# Altium schematic sheet 4_1_frontend.SchDoc: RF FrontEnd module
size A4; OrganizationName: Pluton UPV; Address1: Universitat Politècnica; Address2: de València (UPV); Address3: Camí de Vera, València; Address4: Spain; SheetNumber: 5; SheetTotal: 6
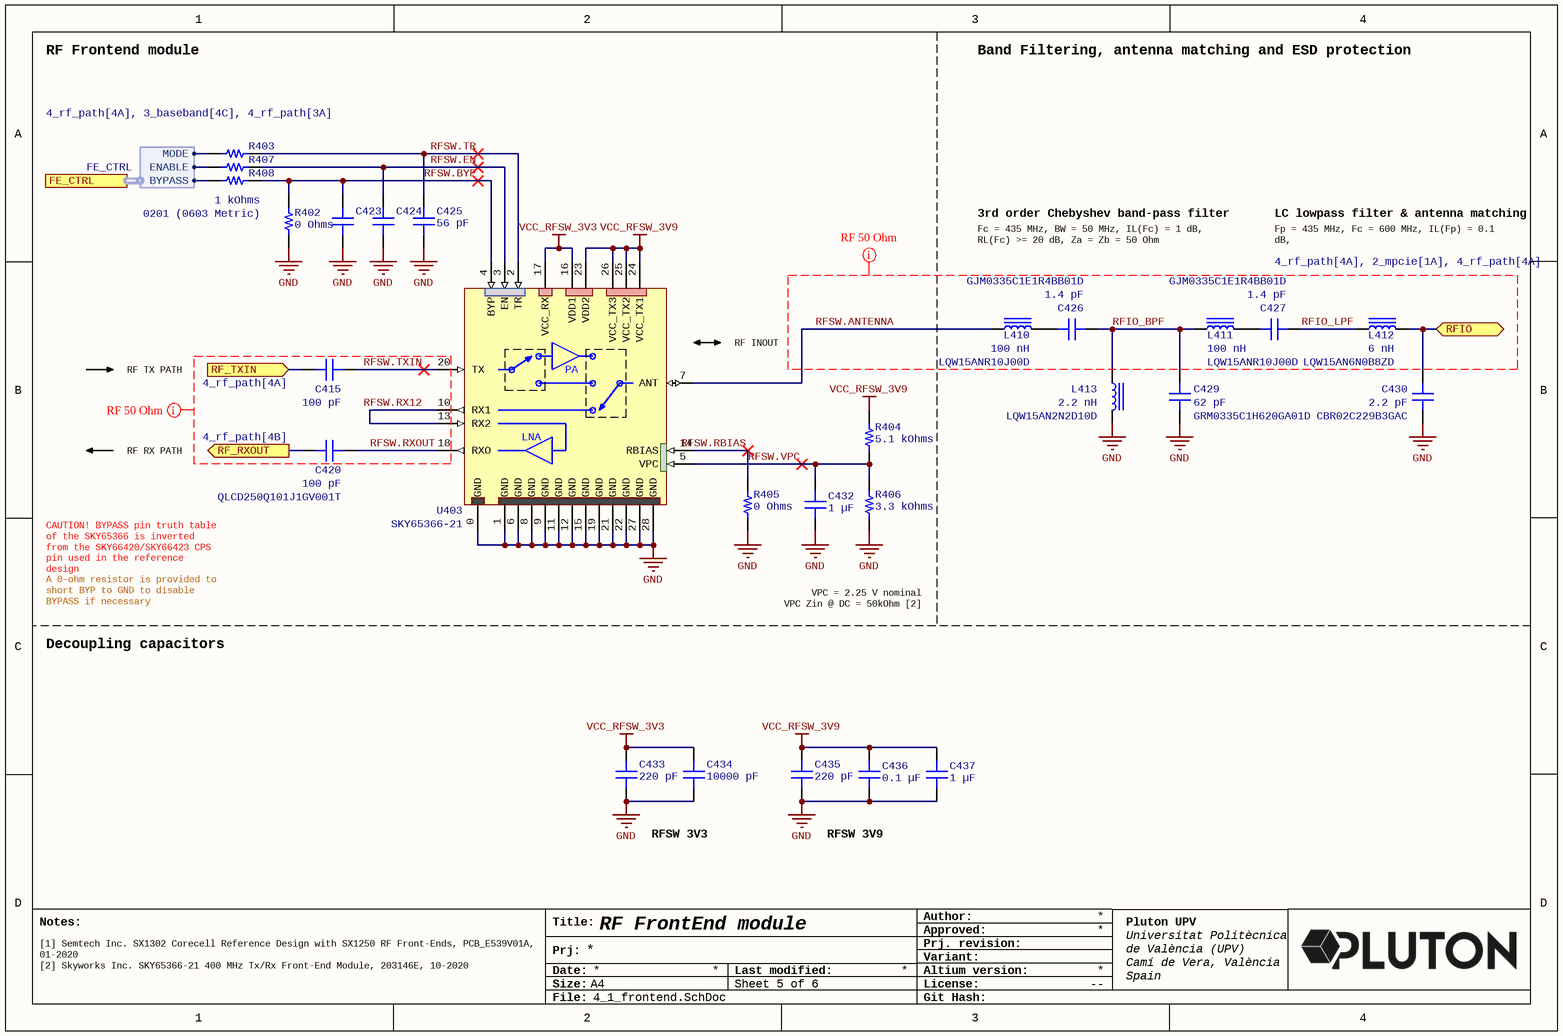
[diagram p0: 4_1_frontend.SchDoc]

## Parts
C415  Part Number: QLCD250Q101J1GV001T  [CAP 0201_0603 RF]  (hidden comment: 100 pF)
C420  100 pF  [CAP 0201_0603 RF]
C423  56 pF  [CAP 0201_0603]  (value not drawn)
C424  56 pF  [CAP 0201_0603]  (value not drawn)
C425  56 pF  [CAP 0201_0603]
C426  Part Number: GJM0335C1E1R4BB01D  [CAP 0201_0603 RF]  (hidden comment: 1.4 pF)
C427  Part Number: GJM0335C1E1R4BB01D  [CAP 0201_0603 RF]  (hidden comment: 1.4 pF)
C429  Part Number: GRM0335C1H620GA01D  [CAP 0201_0603]  (hidden comment: 62 pF)
C430  Part Number: CBR02C229B3GAC  [CAP 0201_0603 RF]  (hidden comment: 2.2 pF)
C432  1 µF  [CAP 0402_1005]
C433  220 pF  [CAP 0201_0603]
C434  10000 pF  [CAP 0402_1005]
C435  220 pF  [CAP 0201_0603]
C436  0.1 µF  [CAP 0402_1005]
C437  1 µF  [CAP 0402_1005]
L410  Part Number: LQW15ANR10J00D  [IND 0402_1005 RF WW]  (hidden comment: 100 nH)
L411  Part Number: LQW15ANR10J00D  [IND 0402_1005 RF WW]  (hidden comment: 100 nH)
L412  Part Number: LQW15AN6N0B8ZD  [IND 0402_1005 RF WW]  (hidden comment: 6 nH)
L413  Part Number: LQW15AN2N2D10D  [IND 0402_1005 RF WW]  (hidden comment: 2.2 nH)
R402  0 Ohms  [RES 0201_0603]
R403  Device Package: 0201 (0603 Metric)  [RES 0201_0603]  (hidden comment: 1 kOhms)
R404  5.1 kOhms  [RES 0201_0603]
R405  0 Ohms  [RES 0201_0603]
R406  3.3 kOhms  [RES 0201_0603]
R407  1 kOhms  [RES 0201_0603]  (value not drawn)
R408  1 kOhms  [RES 0201_0603]  (value not drawn)
U403  SKY65366-21  [MCM-28-SKY65366-21]

## Ports
FE_CTRL (harness FE_CTRL, see 4_rf_path[4A], 3_baseband[4C], 4_rf_path[3A]), RF_RXOUT (out, see 4_rf_path[4B]), RF_TXIN (in, see 4_rf_path[4A]), RFIO (bidir, see 4_rf_path[4A], 2_mpcie[1A], 4_rf_path[4A])

## Harnesses
FE_CTRL: MODE, ENABLE, BYPASS

## Nets
GND: C423.1 C424.1 C425.1 C429.1 C430.1 C432.1 C433.1 C434.1 C435.1 C436.1 C437.1 L413.2 R402.1 R405.1 R406.1 U403.0(GND) U403.1(GND) U403.6(GND) U403.8(GND) U403.9(GND) U403.11(GND) U403.12(GND) U403.15(GND) U403.19(GND) U403.21(GND) U403.22(GND) U403.27(GND) U403.28(GND)
VCC_RFSW_3V3: C433.2 C434.2 U403.16(VDD1) U403.17(VCC_RX)
VCC_RFSW_3V9: C435.2 C436.2 C437.2 R404.2 U403.23(VDD2) U403.24(VCC_TX1) U403.25(VCC_TX2) U403.26(VCC_TX3)
RF_RXOUT: C420.1 ; port RF_RXOUT
RF_TXIN: C415.1 ; port RF_TXIN
RFIO: C430.2 L412.2 ; port RFIO
RFIO_BPF: C426.2 C429.2 L411.1 L413.1
RFIO_LPF: C427.2 L412.1
RFSW.ANTENNA: L410.1 U403.7(ANT)
RFSW.BYP: C423.2 R402.2 R408.2 U403.4(BYP)
RFSW.EN: C424.2 R407.2 U403.3(EN)
RFSW.RBIAS: R405.2 U403.14(RBIAS)
RFSW.RX12: U403.10(RX1) U403.13(RX2)
RFSW.RXOUT: C420.2 U403.18(RXO)
RFSW.TR: C425.2 R403.2 U403.2(TR)
RFSW.TXIN: C415.2 U403.20(TX)
RFSW.VPC: C432.2 R404.1 R406.2 U403.5(VPC)
NetC426_1: C426.1 L410.2
NetC427_1: C427.1 L411.2
NetR403_1: R403.1 ; port FE_CTRL.MODE
NetR407_1: R407.1 ; port FE_CTRL.ENABLE
NetR408_1: R408.1 ; port FE_CTRL.BYPASS

## Layout directives
net class RF50; rule Width Constraint [Pref Impedance = 50.00ohms    Min Impedance = 50.00ohms    Max Impedance = 50.00ohms]; rule Clearance Constraint [Clearance = 0.2mm]: RFIO_BPF, RFIO_LPF, RFSW.ANTENNA, RFSW.RX12, RFSW.RXOUT, RFSW.TXIN

## Notes on the sheet
- RF Frontend module
- Band Filtering, antenna matching and ESD protection
- 3rd order Chebyshev band-pass filter
- Fc = 435 MHz, BW = 50 MHz, IL(Fc) = 1 dB, RL(Fc) >= 20 dB, Za = Zb = 50 Ohm
- LC lowpass filter & antenna matching
- Fp = 435 MHz, Fc = 600 MHz, IL(Fp) = 0.1 dB,
  RL(Fp) >= 50 dB, Zin = 50 Ohm, Zant = 55 Ohm
- RF TX PATH
- RF INOUT
- RF RX PATH
- CAUTION! BYPASS pin truth table of the SKY65366 is inverted from the SKY66420/SKY66423 CPS pin used in the reference design
- A 0-ohm resistor is provided to short BYP to GND to disable BYPASS if necessary
- Decoupling capacitors
- VPC = 2.25 V nominal
  VPC Zin @ DC = 50kOhm [2]
- RFSW 3V3
- RFSW 3V9
- [1] Semtech Inc. SX1302 Corecell Reference Design with SX1250 RF Front-Ends, PCB_E539V01A, 01-2020
  [2] Skyworks Inc. SKY65366-21 400 MHz Tx/Rx Front-End Module, 203146E, 10-2020
- Notes:
- Title:
- Author:
- Approved:
- Date:
- Prj:
- Size:
- A4
- Last modified:
- Altium version:
- Variant:
- Prj. revision:
- License:
- --
- File:
- Git Hash:
- (in symbol SKY65366-21) PA; LNA

## Library data of the parts
C415 C420 = QLCD250Q101J1GV001T: CAP CER 100PF 25V C0G/NP0 0201; manufacturer: Johanson Technology Inc.; Temperature Coefficient: C0G, NP0; Tolerance: ±5%; Applications: RF, Microwave, High Frequency; Capacitance: 100 pF; componentlink1description: Datasheet; componentlink1url: https://www.johansontechnology.com/downloads/catalog/johanson-technology-multi-layer-high-q-capacitors.pdf; componentlink2description: DigiKey Link; componentlink2url: https://www.digikey.com/en/products/detail/johanson-technology-inc/QLCD250Q101J1GV001T/1561511; Device Package: 0201 (0603 Metric); Features: High Q, Low Loss; lastupdated: 03/06/2024 19:34:07; Lifecycle Status: Active; Minimum Order: 1; Mounting Type: Surface Mount, MLCC; Operating Temperature: -55°C ~ 125°C; Package / Case: 0201 (0603 Metric); packaging: TapeAndReel; partid: 3724; Part Status: Active; price: 0.02; series: L; Size / Dimension: 0.024" L x 0.012" W (0.60mm x 0.30mm); Supplier 1: DigiKey; Supplier Part Number 1: 712-QLCD250Q101J1GV001TCT-ND; Thickness (Max): 0.013" (0.33mm); value: 100 pF; Voltage - Rated: 25V
  C420: Part Number: QLCD250Q101J1GV001T
C423-C425 = GRM0335C1H560GA01D: CAP CER 56PF 50V C0G/NP0 0201; manufacturer: Murata Electronics; Temperature Coefficient: C0G, NP0; Tolerance: ±2%; Part Number: GRM0335C1H560GA01D; Value: 56 pF; Applications: General Purpose; Capacitance: 56 pF; componentlink1description: Datasheet; componentlink1url: https://search.murata.co.jp/Ceramy/image/img/A01X/G101/ENG/GRM0335C1H560GA01-01.pdf; componentlink2description: DigiKey Link; componentlink2url: https://www.digikey.com/en/products/detail/murata-electronics/GRM0335C1H560GA01D/4358755; Device Package: 0201 (0603 Metric); lastupdated: 04/06/2024 19:01:09; Lifecycle Status: Active; Minimum Order: 1; Mounting Type: Surface Mount; Operating Temperature: -55°C ~ 125°C; Package / Case: 0201 (0603 Metric); packaging: CutTape; partid: 528; Part Status: Active; price: 0.01; series: GRM; Size / Dimension: 0.024" L x 0.012" W (0.60mm x 0.30mm); Supplier 1: DigiKey; Supplier Part Number 1: 490-13329-1-ND; Thickness (Max): 0.013" (0.33mm); Voltage - Rated: 50V
C426 C427 = GJM0335C1E1R4BB01D: CAP CER 1.4PF 25V C0G/NP0 0201; manufacturer: Murata Electronics; Temperature Coefficient: C0G, NP0; Tolerance: ±0.1pF; Applications: RF, Microwave, High Frequency; Capacitance: 1.4 pF; componentlink1description: Datasheet; componentlink1url: https://search.murata.co.jp/Ceramy/image/img/A01X/G101/ENG/GJM0335C1E1R4BB01-01.pdf; componentlink2description: DigiKey Link; componentlink2url: https://www.digikey.com/en/products/detail/murata-electronics/GJM0335C1E1R4BB01D/2592522; Device Package: 0201 (0603 Metric); Features: High Q, Low Loss; lastupdated: 03/06/2024 19:34:09; Lifecycle Status: Active; Minimum Order: 1; Mounting Type: Surface Mount; Operating Temperature: -55°C ~ 125°C; Package / Case: 0201 (0603 Metric); packaging: TapeAndReel; partid: 255; Part Status: Active; price: 0.01; series: GJM; Size / Dimension: 0.024" L x 0.012" W (0.60mm x 0.30mm); Supplier 1: DigiKey; Supplier Part Number 1: 490-11174-1-ND; Thickness (Max): 0.013" (0.33mm); value: 1.4 pF; Voltage - Rated: 25V
C429 = GRM0335C1H620GA01D: CAP CER 62PF 50V C0G/NP0 0201; manufacturer: Murata Electronics; Temperature Coefficient: C0G, NP0; Tolerance: ±2%; Value: 62 pF; Applications: General Purpose; Capacitance: 62 pF; componentlink1description: Datasheet; componentlink1url: https://www.murata.com/~/media/webrenewal/support/library/catalog/products/capacitor/mlcc/c02e.ashx?la=en-us; componentlink2description: DigiKey Link; componentlink2url: https://www.digikey.com/en/products/detail/murata-electronics/GRM0335C1H620GA01D/4358769; Device Package: 0201 (0603 Metric); lastupdated: 04/06/2024 19:01:09; Lifecycle Status: Active; Minimum Order: 1; Mounting Type: Surface Mount; Operating Temperature: -55°C ~ 125°C; Package / Case: 0201 (0603 Metric); packaging: CutTape; partid: 542; Part Status: Active; price: 0.01; series: GRM; Size / Dimension: 0.024" L x 0.012" W (0.60mm x 0.30mm); Supplier 1: DigiKey; Supplier Part Number 1: 490-11337-1-ND; Thickness (Max): 0.013" (0.33mm); Voltage - Rated: 50V
C430 = CBR02C229B3GAC: CAP CER 2.2PF 25V C0G/NP0 0201; manufacturer: KEMET; Temperature Coefficient: C0G, NP0; Tolerance: ±0.1pF; Applications: RF, Microwave, High Frequency; Capacitance: 2.2 pF; componentlink1description: Datasheet; componentlink1url: https://api.kemet.com/component-edge/download/datasheet/CBR02C229B3GAC.pdf; componentlink2description: DigiKey Link; componentlink2url: https://www.digikey.com/en/products/detail/kemet/CBR02C229B3GAC/3479233; Device Package: 0201 (0603 Metric); Features: High Q, Low Loss, Ultra Low ESR; lastupdated: 03/06/2024 19:34:10; Lifecycle Status: Active; Minimum Order: 1; Mounting Type: Surface Mount, MLCC; Operating Temperature: -55°C ~ 125°C; Package / Case: 0201 (0603 Metric); packaging: TapeAndReel; partid: 161; Part Status: Active; price: 0.02; series: CBR-SMD RF C0G; Size / Dimension: 0.024" L x 0.012" W (0.60mm x 0.30mm); Supplier 1: DigiKey; Supplier Part Number 1: 399-8607-1-ND; Thickness (Max): 0.013" (0.33mm); value: 2.2 pF; Voltage - Rated: 25V
C432 = CL05A105KO5NNNC: CAP CER 1UF 16V X5R 0402; manufacturer: Samsung Electro-Mechanics; Tolerance: ±10%; Part Number: CL05A105KO5NNNC; Value: 1 µF; Applications: General Purpose; Capacitance: 1 µF; componentlink1description: Datasheet; componentlink1url: http://www.samsungsem.com/kr/support/product-search/mlcc/CL05A105KO5NNNC.jsp; componentlink2description: DigiKey Link; componentlink2url: https://www.digikey.com/en/products/detail/samsung-electro-mechanics/CL05A105KO5NNNC/3886725; Device Package: 0402 (1005 Metric); lastupdated: 09/02/2024 20:04:35; Lifecycle Status: Active; Minimum Order: 1; Mounting Type: Surface Mount, MLCC; Operating Temperature: -55°C ~ 85°C; Package / Case: 0402 (1005 Metric); packaging: TapeAndReel; partid: 3120; Part Status: Active; price: 0.01; series: CL; Size / Dimension: 0.039" L x 0.020" W (1.00mm x 0.50mm); Supplier 1: DigiKey; Supplier Part Number 1: 1276-1067-1-ND; Temperature Coefficient: X5R; Thickness (Max): 0.022" (0.55mm); Voltage - Rated: 16V
C433 C435 = GRM0335C1H221JA01D: CAP CER 220PF 50V C0G/NP0 0201; manufacturer: Murata Electronics; Temperature Coefficient: C0G, NP0; Tolerance: ±5%; Part Number: GRM0335C1H221JA01D; Value: 220 pF; Applications: General Purpose; Capacitance: 220 pF; componentlink1description: Datasheet; componentlink1url: https://search.murata.co.jp/Ceramy/image/img/A01X/G101/ENG/GRM0335C1H221JA01-01.pdf; componentlink2description: DigiKey Link; componentlink2url: https://www.digikey.com/en/products/detail/murata-electronics/GRM0335C1H221JA01D/4904370; Device Package: 0201 (0603 Metric); lastupdated: 04/06/2024 19:01:09; Lifecycle Status: Active; Minimum Order: 1; Mounting Type: Surface Mount; Operating Temperature: -55°C ~ 125°C; Package / Case: 0201 (0603 Metric); packaging: CutTape; partid: 574; Part Status: Active; price: 0.01; series: GRM; Size / Dimension: 0.024" L x 0.012" W (0.60mm x 0.30mm); Supplier 1: DigiKey; Supplier Part Number 1: 490-11316-1-ND; Thickness (Max): 0.013" (0.33mm); Voltage - Rated: 50V
C434 = GRM1555C1E103JE01J: CAP CER 10000PF 25V C0G/NP0 0402; manufacturer: Murata Electronics; Temperature Coefficient: C0G, NP0; Tolerance: ±5%; Part Number: GRM1555C1E103JE01J; Value: 10000 pF; Applications: General Purpose; Capacitance: 10000 pF; componentlink1description: Datasheet; componentlink1url: https://search.murata.co.jp/Ceramy/image/img/A01X/G101/ENG/GRM1555C1E103JE01-01A.pdf; componentlink2description: DigiKey Link; componentlink2url: https://www.digikey.com/en/products/detail/murata-electronics/GRM1555C1E103JE01J/16033801; Device Package: 0402 (1005 Metric); lastupdated: 09/02/2024 20:04:09; Lifecycle Status: Active; Minimum Order: 1; Mounting Type: Surface Mount, MLCC; Operating Temperature: -55°C ~ 125°C; Package / Case: 0402 (1005 Metric); packaging: TapeAndReel; partid: 41084; Part Status: Active; price: 0.02; series: GRM; Size / Dimension: 0.039" L x 0.020" W (1.00mm x 0.50mm); Supplier 1: DigiKey; Supplier Part Number 1: 490-GRM1555C1E103JE01JCT-ND; Thickness (Max): 0.026" (0.65mm); Voltage - Rated: 25V
C436 = C0402C104K4RECAUTO: CAP CER 0402 0.1UF 16V X7R 10%; manufacturer: KEMET; Part Number: C0402C104K4RECAUTO; Value: 0.1 µF; Applications: Automotive, ESD Protection; Capacitance: 0.1 µF; componentlink1description: Datasheet; componentlink1url: https://api.kemet.com/component-edge/download/datasheet/C0402C104K4RECAUTO.pdf; componentlink2description: DigiKey Link; componentlink2url: https://www.digikey.com/en/products/detail/kemet/C0402C104K4RECAUTO/8563695; Device Package: 0402 (1005 Metric); lastupdated: 09/02/2024 20:04:38; Lifecycle Status: Active; Minimum Order: 1; Mounting Type: Surface Mount, MLCC; Operating Temperature: -55°C ~ 125°C; Package / Case: 0402 (1005 Metric); packaging: TapeAndReel; partid: 1731; Part Status: Active; price: 0.01; Ratings: AEC-Q200; series: ESD SMD Auto X7R; Size / Dimension: 0.039" L x 0.020" W (1.00mm x 0.50mm); Supplier 1: DigiKey; Supplier Part Number 1: 399-17167-1-ND; Temperature Coefficient: X7R; Thickness (Max): 0.022" (0.55mm); Tolerance: ±10%; Voltage - Rated: 16V
C437 = GRT155C71A105KE13D: CAP CER 1UF 10V X7S 0402; manufacturer: Murata Electronics; Tolerance: ±10%; Part Number: GRT155C71A105KE13D; Value: 1 µF; Applications: Automotive; Capacitance: 1 µF; componentlink1description: Datasheet; componentlink1url: https://search.murata.co.jp/Ceramy/image/img/A01X/G101/ENG/GRT155C71A105KE13-01.pdf; componentlink2description: DigiKey Link; componentlink2url: https://www.digikey.com/en/products/detail/murata-electronics/GRT155C71A105KE13D/10695747; Device Package: 0402 (1005 Metric); lastupdated: 09/02/2024 20:04:05; Lifecycle Status: Active; Minimum Order: 1; Mounting Type: Surface Mount, MLCC; Operating Temperature: -55°C ~ 125°C; Package / Case: 0402 (1005 Metric); packaging: TapeAndReel; partid: 47127; Part Status: Active; price: 0.04; Ratings: AEC-Q200; series: GRT; Size / Dimension: 0.039" L x 0.020" W (1.00mm x 0.50mm); Supplier 1: DigiKey; Supplier Part Number 1: 490-GRT155C71A105KE13DCT-ND; Temperature Coefficient: X7S; Thickness (Max): 0.024" (0.60mm); Voltage - Rated: 10V
L410 L411 = LQW15ANR10J00D: FIXED IND 100NH 120MA 2.52OHM SM; Manufacturer: Murata Electronics; DC Resistance (DCR): 2.52Ohm Max; Frequency - Self Resonant: 1.5GHz; Inductance Frequency - Test: 100 MHz; Material - Core: Non-Magnetic; Q @ Freq: 20 @ 150MHz; Shielding: Unshielded; Tolerance: ±5%; Type: Drum Core, Wirewound; ComponentLink1Description: Datasheet; ComponentLink1URL: https://search.murata.co.jp/Ceramy/image/img/P02/JELF243A-0050.pdf; ComponentLink2Description: DigiKey Link; ComponentLink2URL: https://www.digikey.com/en/products/detail/murata-electronics/LQW15ANR10J00D/1016249; Current Rating (Amps): 120 mA; Device Package: 0402 (1005 Metric); Height - Seated (Max): 0.024" (0.60mm); Inductance: 100 nH; LastUpdated: 03/06/2024 20:03:22; Lifecycle Status: Active; Minimum Order: 1; Mounting Type: Surface Mount; Operating Temperature: -55°C ~ 125°C; Package / Case: 0402 (1005 Metric); Packaging: TapeAndReel; PartId: 282; Part Status: Active; Price: 0.04; Series: LQW15; Size / Dimension: 0.039" L x 0.020" W (1.00mm x 0.50mm); Supplier 1: DigiKey; Supplier Part Number 1: 490-4090-1-ND; Value: 100 nH
L412 = LQW15AN6N0B8ZD: FIXED IND 6NH 1.6A 0.056OHM SMD; Manufacturer: Murata Electronics; DC Resistance (DCR): 56mOhm Max; Frequency - Self Resonant: 8GHz; Inductance Frequency - Test: 100 MHz; Material - Core: Non-Magnetic; Q @ Freq: 32 @ 250MHz; Shielding: Unshielded; Tolerance: ±0.1nH; Type: Drum Core, Wirewound; ComponentLink1Description: Datasheet; ComponentLink1URL: https://search.murata.co.jp/Ceramy/image/img/P02/JELF243A-9138.pdf; ComponentLink2Description: DigiKey Link; ComponentLink2URL: https://www.digikey.com/en/products/detail/murata-electronics/LQW15AN6N0B8ZD/6798964; Current Rating (Amps): 1.6 A; Device Package: 0402 (1005 Metric); Height - Seated (Max): 0.024" (0.60mm); Inductance: 6 nH; LastUpdated: 03/06/2024 20:03:25; Lifecycle Status: Active; Minimum Order: 1; Mounting Type: Surface Mount; Operating Temperature: -55°C ~ 125°C; Package / Case: 0402 (1005 Metric); Packaging: TapeAndReel; PartId: 40; Part Status: Active; Price: 0.07; Ratings: AEC-Q200; Series: LQW15; Size / Dimension: 0.039" L x 0.024" W (1.00mm x 0.60mm); Supplier 1: DigiKey; Supplier Part Number 1: 490-15539-1-ND; Value: 6 nH
L413 = LQW15AN2N2D10D: FIXED IND 2.2NH 1A 0.027OHM SMD; Manufacturer: Murata Electronics; DC Resistance (DCR): 27mOhm Max; Frequency - Self Resonant: 14GHz; Inductance Frequency - Test: 100 MHz; Material - Core: Non-Magnetic; Q @ Freq: 25 @ 250MHz; Shielding: Unshielded; Tolerance: ±0.5nH; Type: Drum Core, Wirewound; ComponentLink1Description: Datasheet; ComponentLink1URL: https://search.murata.co.jp/Ceramy/image/img/P02/JELF243A-0051.pdf; ComponentLink2Description: DigiKey Link; ComponentLink2URL: https://www.digikey.com/en/products/detail/murata-electronics/LQW15AN2N2D10D/2594881; Current Rating (Amps): 1 A; Device Package: 0402 (1005 Metric); Height - Seated (Max): 0.024" (0.60mm); Inductance: 2.2 nH; LastUpdated: 03/06/2024 20:03:23; Lifecycle Status: Active; Minimum Order: 1; Mounting Type: Surface Mount; Operating Temperature: -55°C ~ 125°C; Package / Case: 0402 (1005 Metric); Packaging: TapeAndReel; PartId: 170; Part Status: Active; Price: 0.05; Series: LQW15; Size / Dimension: 0.039" L x 0.024" W (1.00mm x 0.60mm); Supplier 1: DigiKey; Supplier Part Number 1: 490-6795-1-ND; Value: 2.2 nH
R402 R405 = AC0201JR-070RL: RES SMD 0 OHM JUMPER 1/20W 0201; Manufacturer: Yageo; Power (Watts): 0.05W, 1/20W; Part Number: AC0201JR-070RL; Value: 0 Ohms; ComponentLink1Description: Datasheet; ComponentLink1URL: https://www.yageo.com/upload/media/product/productsearch/datasheet/rchip/PYu-AC_51_RoHS_L_7.pdf; ComponentLink2Description: DigiKey Link; ComponentLink2URL: https://www.digikey.com/en/products/detail/yageo/AC0201JR-070RL/5894880; Composition: Thick Film; Device Package: 0201 (0603 Metric); Features: Automotive AEC-Q200, Moisture Resistant; Height - Seated (Max): 0.010" (0.26mm); LastUpdated: 04/06/2024 19:12:00; Lifecycle Status: Active; Minimum Order: 1; Number of Terminations: 2; Operating Temperature: -55°C ~ 155°C; Package / Case: 0201 (0603 Metric); Packaging: CutTape; PartId: 818; Part Status: Active; Price: 0.01; Ratings: AEC-Q200; Resistance: 0 Ohms; Series: AC; Size / Dimension: 0.024" L x 0.012" W (0.60mm x 0.30mm); Supplier 1: DigiKey; Supplier Part Number 1: YAG3427CT-ND; Supplier Device Package: 0201; Tolerance: Jumper
R403 R407 R408 = RC0201FR-071KL: RES 1K OHM 1% 1/20W 0201; Manufacturer: Yageo; Power (Watts): 0.05W, 1/20W; Temperature Coefficient: ±200ppm/°C; Part Number: RC0201FR-071KL; Value: 1 kOhms; ComponentLink1Description: Datasheet; ComponentLink1URL: https://www.yageo.com/upload/media/product/productsearch/datasheet/rchip/PYu-RC_Group_51_RoHS_L_10.pdf; ComponentLink2Description: DigiKey Link; ComponentLink2URL: https://www.digikey.com/en/products/detail/yageo/RC0201FR-071KL/3202389; Composition: Thick Film; Features: Moisture Resistant; Height - Seated (Max): 0.010" (0.26mm); LastUpdated: 04/06/2024 19:11:56; Lifecycle Status: Active; Minimum Order: 1; Number of Terminations: 2; Operating Temperature: -55°C ~ 125°C; Package / Case: 0201 (0603 Metric); Packaging: TapeAndReel; PartId: 2286; Part Status: Active; Price: 0.01; Resistance: 1 kOhms; Series: RC_L; Size / Dimension: 0.024" L x 0.012" W (0.60mm x 0.30mm); Supplier 1: DigiKey; Supplier Part Number 1: 311-1KMCT-ND; Supplier Device Package: 0201; Tolerance: ±1%
  R407 R408: Device Package: 0201 (0603 Metric)
R404 = ERJ-1GNF5101C: RES SMD 5.1K OHM 1% 1/20W 0201; Manufacturer: Panasonic Electronic Components; Power (Watts): 0.05W, 1/20W; Temperature Coefficient: ±200ppm/°C; Part Number: ERJ-1GNF5101C; Value: 5.1 kOhms; ComponentLink1Description: Datasheet; ComponentLink1URL: https://industrial.panasonic.com/cdbs/www-data/pdf/RDA0000/AOA0000C304.pdf; ComponentLink2Description: DigiKey Link; ComponentLink2URL: https://www.digikey.com/en/products/detail/panasonic-electronic-components/ERJ-1GNF5101C/2036192; Composition: Thick Film; Device Package: 0201 (0603 Metric); Features: Automotive AEC-Q200; Height - Seated (Max): 0.010" (0.26mm); LastUpdated: 04/06/2024 19:11:52; Lifecycle Status: Active; Minimum Order: 1; Number of Terminations: 2; Operating Temperature: -55°C ~ 125°C; Package / Case: 0201 (0603 Metric); Packaging: TapeAndReel; PartId: 4177; Part Status: Active; Price: 0.01; Ratings: AEC-Q200; Resistance: 5.1 kOhms; Series: ERJ-1GN; Size / Dimension: 0.024" L x 0.012" W (0.60mm x 0.30mm); Supplier 1: DigiKey; Supplier Part Number 1: P123051CT-ND; Supplier Device Package: 0201; Tolerance: ±1%
R406 = ERJ-1GJF3301C: RES SMD 3.3K OHM 1% 1/20W 0201; Manufacturer: Panasonic Electronic Components; Power (Watts): 0.05W, 1/20W; Temperature Coefficient: ±200ppm/°C; Part Number: ERJ-1GJF3301C; Value: 3.3 kOhms; ComponentLink1Description: Datasheet; ComponentLink1URL: https://api.pim.na.industrial.panasonic.com/file_stream/main/fileversion/1263; ComponentLink2Description: DigiKey Link; ComponentLink2URL: https://www.digikey.com/en/products/detail/panasonic-electronic-components/ERJ-1GJF3301C/19101344; Composition: Thick Film; Device Package: 0201 (0603 Metric); Features: Automotive AEC-Q200; Height - Seated (Max): 0.010" (0.26mm); LastUpdated: 04/06/2024 19:11:47; Lifecycle Status: Active; Minimum Order: 1; Number of Terminations: 2; Operating Temperature: -55°C ~ 125°C; Package / Case: 0201 (0603 Metric); Packaging: TapeAndReel; PartId: 80200; Price: 0.02; Ratings: AEC-Q200; Resistance: 3.3 kOhms; Series: ERJ-1GJ; Size / Dimension: 0.024" L x 0.012" W (0.60mm x 0.30mm); Supplier 1: DigiKey; Supplier Part Number 1: 10-ERJ-1GJF3301CCT-ND; Supplier Device Package: 0201; Tolerance: ±1%
U403 = SKY65366-21: 400 MHz Transmit/Receive Front-End Module